# Altium schematic sheet Encoder_1.SchDoc
size A4; CompanyName: Technische Hochschule Nürnberg Georg Simon Ohm; Organization: UltraZohm; Address1: Kesslerplatz 12; Address2: 90489 Nürnberg; Address3: GERMANY; Website: www.ultrazohm.com
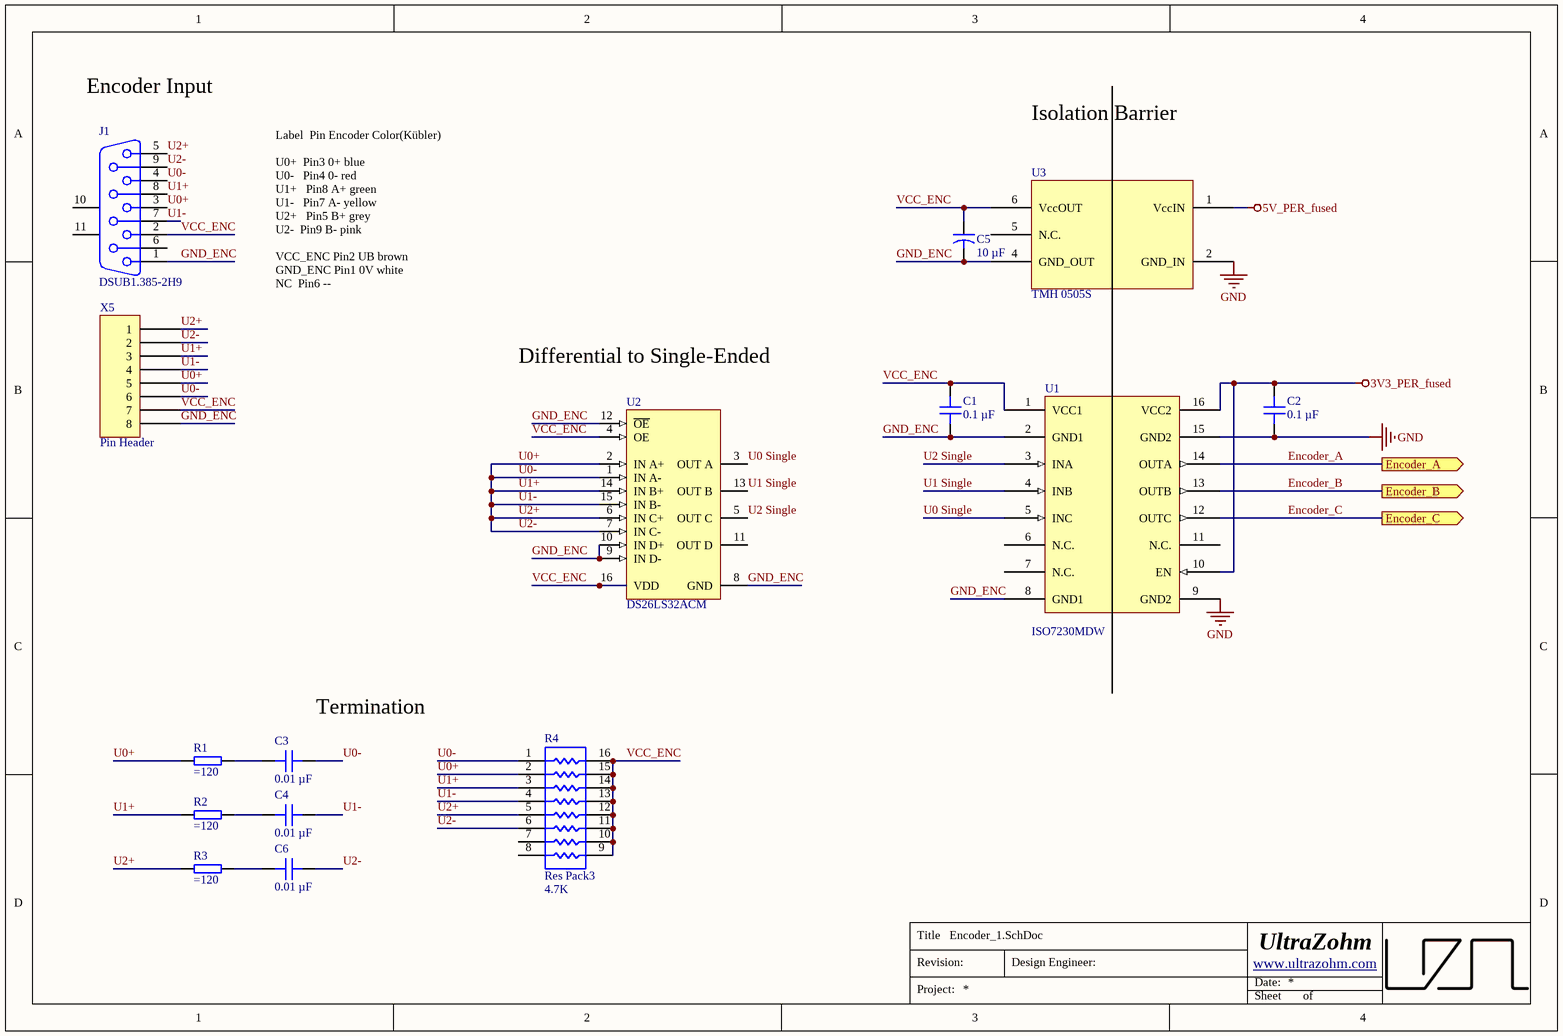
[diagram p0: Encoder_1.SchDoc]

## Parts
C1  0.1 µF  [C_0805]
C2  0.1 µF  [C_0805]
C3  0.01 µF  [C_0805]
C4  0.01 µF  [C_0805]
C5  10 µF  [CAPR5-4X5]
C6  0.01 µF  [C_0805]
J1  DSUB1.385-2H9  [DSUB1.385-2H9]
R1  (no value)  [RES 0805_2012]
R2  (no value)  [RES 0805_2012]
R3  (no value)  [RES 0805_2012]
R4  Res Pack3  value 4.7K  [SO-16_N]
U1  ISO7230MDW  [TI ISO7230 SOIC]
U2  DS26LS32ACM  [M16A_M]
U3  TMH 0505S  [SIL-6(7)]
X5  Pin Header  [HDR1X8]

## Ports
Encoder_A (out), Encoder_B (out), Encoder_C (out)

## Nets
3V3_PER_fused: C2.2 U1.10(EN) U1.16(VCC2)
5V_PER_fused: U3.1(VccIN)
GND: C2.1 U1.9(GND2) U1.15(GND2) U3.2(GND_IN)
Encoder_A: U1.14(OUTA) ; port Encoder_A
Encoder_B: U1.13(OUTB) ; port Encoder_B
Encoder_C: U1.12(OUTC) ; port Encoder_C
GND_ENC: C1.1 C5.2 J1.1 U1.2(GND1) U1.8(GND1) U2.8(GND) U2.9(IN_D-) U2.10(IN_D+) U2.12(~{OE}) U3.4(GND_OUT) X5.8
U0 Single: U1.5(INC) U2.3(OUT_A)
U0+: C3.2 C4.2 C6.2 J1.3 J1.4 J1.5 J1.7 J1.8 J1.9 R1.1 R2.1 R3.1 R4.1 R4.2 R4.3 R4.4 R4.5 R4.6 U2.1(IN_A-) U2.2(IN_A+) U2.6(IN_C+) U2.7(IN_C-) U2.14(IN_B+) U2.15(IN_B-) X5.1 X5.2 X5.3 X5.4 X5.5 X5.6  [also labelled U0-, U1+, U1-, U2+, U2-]
U1 Single: U1.4(INB) U2.13(OUT_B)
U2 Single: U1.3(INA) U2.5(OUT_C)
VCC_ENC: C1.2 C5.1 J1.2 R4.9 R4.10 R4.11 R4.12 R4.13 R4.14 R4.15 R4.16 U1.1(VCC1) U2.4(OE) U2.16(VDD) U3.6(VccOUT) X5.7
NetC3_1: C3.1 R1.2
NetC4_1: C4.1 R2.2
NetC6_1: C6.1 R3.2

Not connected (* = marked no-connect by the designer): J1 6 10(MH1) 11(MH2); R4 7 8; U1 6(N.C.) 7(N.C.) 11(N.C.); U2 11(OUT_D); U3 5(N.C.)

## Notes on the sheet
- Encoder Input
- Isolation Barrier
- Label		Pin	Encoder	Color(Kübler)
  U0+		Pin3	0+	blue
  U0- 		Pin4	0-	red
  U1+ 		Pin8	A+	green
  U1- 		Pin7	A-	yellow
  U2+ 		Pin5	B+	grey
  U2-		Pin9	B-	pink
  VCC_ENC	Pin2	UB	brown
  GND_ENC	Pin1	0V	white
  NC		Pin6	--
- Differential to Single-Ended
- (near C3) Termination
- Title
- Revision:
- Design Engineer:
- Date:
- Project:
- Sheet
- of

## Library data of the parts
C1 C2 = C0805C104J5RECTU: Capacitor 0805, 50 VDC, 0.1 µF, X7R; Manufacturer: KEMET; Tolerance: 5 %; Voltage Rating: 50 VDC; Created from: MGremer; Manufacturer Part Number: C0805C104J5RECTU; PartID: 17; Created On: 20.12.2020 13:54:13; ComponentLink1Description: Datasheet; ComponentLink1URL: https://www.mouser.de/datasheet/2/212/KEM_C1002_X7R_SMD-1102033.pdf; Component Type: Capacitor 0805; Device Package: 0805; Last Updated: 20.12.2020 16:34:30; Mounting Type: SMD; Operating Temperature: -55 - 125°C; Series: SMD Comm X7R; Supplier 1: Mouser; Supplier Part Number 1: 80-C0805C104J5RECTU; Type: Capacitor; Value: 0.1 µF; Live Cycle Status: 1; Stock number: Labor SMD Container
C3 C4 C6 = GRM21BR72A103KA01L: Capacitor 0805, 100 VDC, 0.01 µF, X7R; Manufacturer: Murata Electronics; Tolerance: 10 %; Voltage Rating: 100 VDC; Created from: MGremer; Manufacturer Part Number: GRM21BR72A103KA01L; PartID: 86; Created On: 20.12.2020 13:54:13; ComponentLink1Description: Datasheet; ComponentLink1URL: https://www.mouser.de/datasheet/2/281/1/GRM21BR72A103KA01_01C-1986947.pdf; Component Type: Capacitor 0805; Device Package: 0805; Last Updated: 17.11.2021 11:27:00; Mounting Type: SMD; Operating Temperature: -55 - 125°C; Series: GRM; Supplier 1: Mouser; Supplier Part Number 1: 81-GRM21BR72A103K; Type: Capacitor; Value: 0.01 µF; Live Cycle Status: 1; Stock number: not stored
C5 = CAPR5-4X5: Capacitor; 2 Leads; Created from: MHlatky; Published: 23-Sep-2002; PackageReference: CAPR5-4X5; Publisher: Altium Limited; PackageDescription: Capacitor; 2 Leads; Value: 10 µF; Manufacturer Part Number: CAPR5-4X5; PartID: 5; Created On: 25.05.2021 10:46:00; ComponentLink1Description: Datasheet; Component Type: Capacitor; Last Updated: 30.11.2021 13:37:41; Supplier Part Number 1: CAPR5-4X5; Type: Capacitor; Live Cycle Status: 1
J1 = DSUB1.385-2H9: Connector; D Subminiature; 9 Position; Right Angle; Pitch 1.385 mm; Manufacturer: Altium; PackageDocument: O; Positions: 9; Gender: Receptacle; Created from: MHlatky; Published: 15-Jun-2001; LatestRevisionDate: 17-Jul-2002; LatestRevisionNote: Re-released for DXP Platform.; DatasheetDocument: 1-Sep-1999; PackageReference: 788750; Publisher: Altium Limited; Orientation: Right Angle; Manufacturer Part Number: DSUB1.385-2H9; PartID: 15; Created On: 26.01.2021 09:19:51; ComponentLink1Description: Datasheet; ComponentLink1URL: [NULL]; Component Type: DSUB Connector; Device Package: -; Last Updated: 20.12.2021 09:43:18; Type: DSUB Connector; Live Cycle Status: 1; Stock number: not stored
R1-R3 = ERJ-6ENF1182V: SMD resistor 1%; Manufacturer: Panasonic; Value: 11k8; Created from: MGremer; Manufacturer Part Number: ERJ-6ENF1182V; PartID: 148; Created On: 14.12.2020 16:17:14; ComponentLink1Description: Datasheet; ComponentLink1URL: https://www.mouser.de/datasheet/2/315/AOA0000C304-1149620.pdf; Component Type: SMD resistor; Device Package: 0805; Last Updated: 14.12.2020 18:22:52; Mounting Type: SMD; Supplier 1: Mouser; Supplier Part Number 1: 667-ERJ-6ENF1182V; Type: Resistor; Tolerance: 1%; Live Cycle Status: 1; Stock number: not stored
R4 = Res Pack3: SOIC, 16-Leads, Body 9.9x3.9mm, Pitch 1.27mm, IPC Medium Density; Created from: MHlatky; Published: 24-Mar-1999; LatestRevisionDate: 29-May-2009; LatestRevisionNote: IPC-7351 Footprint Added.; PackageReference: SO-16; Publisher: Altium Limited; PackageDescription: 16-Pin Small Outline Integrated Circuit 1.27 mm Pitch; Code_JEDEC: MS-012-AC; Code_IPC: SOIC127P600-16; Manufacturer Part Number: Res Pack3; PartID: 207; Created On: 14.12.2020 16:17:14; ComponentLink1Description: Datasheet; Component Type: Res Pack3; Device Package: SOIC; Last Updated: 20.12.2021 09:54:47; Mounting Type: SMD; Supplier 1: Altium; Type: Resistor; Live Cycle Status: 1
U1 = ISO7230MDW: ISO723xx High-Speed, Triple-Channel Digital Isolators; Manufacturer: Analog Devices; Created from: MHlatky; Manufacturer Part Number: ISO7230MDW; PartID: 5; Created On: 26.01.2021 09:03:43; ComponentLink1Description: Datasheet; ComponentLink1URL: https://www.ti.com/lit/ds/symlink/iso7230m.pdf?HQS=dis-mous-null-mousermode-dsf-pf-null-wwe&ts=1639988443497&ref_url=https%253A%252F%252Fwww.mouser.de%252F; Component Type: Microcontroller; Last Updated: 17.06.2021 08:32:47; Mounting Type: SOIC; Operating Temperature: -40 - +125 °C; Supplier 1: Mouser; Supplier Part Number 1: 595-ISO7230MDW; Type: Microcontroller; Live Cycle Status: 1; Stock number: not stored
U2 = DS26LS32ACM: DS26LS32AC/DS26LS32C/DS26LS32M/DS26LS33M Quad Differential Line Receivers; Manufacturer: Texas Instruments; PackageTopMarking: NSUZXYTTE#*DS26LS32*ACM; PowerWise: N; CompType: Interface IC; Created from: MHlatky; Published: 4-Dec-2008; DatasheetVersion: May-1999; PackageVersion: revJ, Aug-1995; PackageReference: M16A; Publisher: Altium Limited; PackageDescription: Molded Package, SO, .150in Wide, 16 Lead; Supplier 1: Mouser; Supplier Part Number 1: 926-DS26LS32ACM; PartNumber: DS26LS32ACM; RoHS: N; PinCount: 16; Code_JEDEC: MS-012-AC; Code_IPC: SOIC127P600-16; ComponentLink1Description: Datasheet; ComponentLink1URL: https://media.digikey.com/pdf/Data%20Sheets/Texas%20Instruments%20PDFs/DS26LS32AC,C,M,DS26LS33M.pdf; ComponentLink2Description: DS26LS32AC Web Page; ComponentLink2URL: http://www.national.com/pf/DS/DS26LS32AC.html; ComponentLink3Description: M16A Package Page; ComponentLink3URL: http://www.national.com/packaging/folders/m16a.html; Manufacturer Part Number: DS26LS32ACM; PartID: 6; Created On: 26.01.2021 09:03:43; Component Type: Microcontroller; Last Updated: 17.06.2021 08:32:47; Mounting Type: SOIC; Operating Temperature: 0 - 70 °C; Type: Microcontroller; Live Cycle Status: 1; Stock number: not stored
U3 = TMH 0505S: ISOLIERTE DC-DC-WANDLER Product Type: DC/DC; Package Style: SIP; Output Power (W): 2; Input Voltage: 5 VDC +/-10%; Output 1 (Vdc): 5; Output 2 (Vdc): N/A; Output 3 (Vdc): N/A; Manufacturer: Traco; Created from: MHlatky; Manufacturer Part Number: TMH 0505S; PartID: 20; Created On: 16.11.2021 07:44:11; ComponentLink1Description: Datasheet; ComponentLink1URL: https://www.tracopower.com/products/tmh.pdf; Component Type: DC-DC Converter; Device Package: SIP; Last Updated: 16.11.2021 07:44:11; Mounting Type: SMD; Operating Temperature: -40 - 85 °C; Series: TMH; Supplier 1: Mouser; Supplier Part Number 1: 495-TMH-0505S; Type: isolated DC-DC Converter; Live Cycle Status: 1; Stock number: not stored
X5 = HDR1X8: 8 Pin; Created from: MHlatky; Manufacturer Part Number: HDR1X8; PartID: 9; Created On: 22.11.2021 15:31:45; ComponentLink1Description: Datasheet; Component Type: Pin Header; Last Updated: 20.12.2021 07:38:08; Supplier 1: Altium; Supplier Part Number 1: HDR1X8; Type: Pin Header; Live Cycle Status: 1; Stock number: not stored